# Altium project RK_NVR_DEMO1_RK3588_LP4XD200P232SD8_V21_20211228.PrjPcb (part 9 of 19)
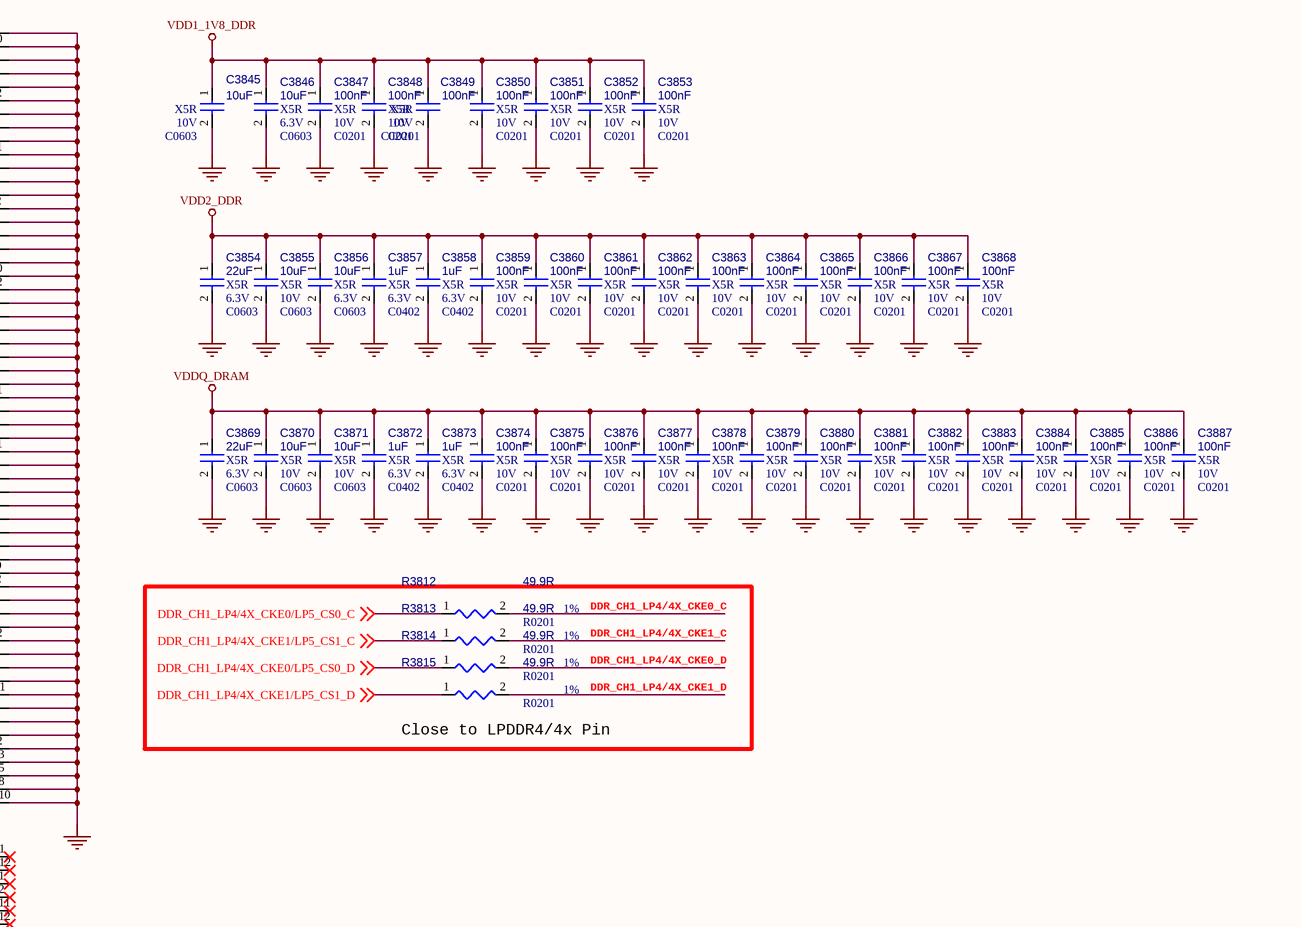
[diagram p80: 38.DRAM-LPDDR4X_200P_1X32bit.SchDoc, bottom right]

## Sheet 38.DRAM-LPDDR4X_200P_1X32bit.SchDoc (continued)

### Nets
GND: C3800.2 C3801.2 C3802.2 C3803.2 C3804.2 C3805.2 C3806.2 C3807.2 C3808.2 C3809.2 C3810.2 C3811.2 C3812.2 C3813.2 C3814.2 C3815.2 C3816.2 C3817.2 C3818.2 C3819.2 C3820.2 C3821.2 C3822.2 C3823.2 C3824.2 C3825.2 C3826.2 C3827.2 C3828.2 C3829.2 C3830.2 C3831.2 C3832.2 C3833.2 C3834.2 C3835.2 C3836.2 C3837.2 C3838.2 C3839.2 C3840.2 C3841.2 C3842.2 C3843.2 C3844.2 C3845.2 C3846.2 C3847.2 C3848.2 C3849.2 C3850.2 C3851.2 C3852.2 C3853.2 C3854.2 C3855.2 C3856.2 C3857.2 C3858.2 C3859.2 C3860.2 C3861.2 C3862.2 C3863.2 C3864.2 C3865.2 C3866.2 C3867.2 C3868.2 C3869.2 C3870.2 C3871.2 C3872.2 C3873.2 C3874.2 C3875.2 C3876.2 C3877.2 C3878.2 C3879.2 C3880.2 C3881.2 C3882.2 C3883.2 C3884.2 C3885.2 C3886.2 C3887.2 C3888.2 U3800.A3(VSS_1) U3800.A10(VSS_2) U3800.AB3(VSS_55) U3800.AB5(VSS_56) U3800.AB8(VSS_57) U3800.AB10(VSS_58) U3800.C1(VSS_3) U3800.C5(VSS_4) U3800.C8(VSS_5) U3800.C12(VSS_6) U3800.D2(VSS_7) U3800.D4(VSS_8) U3800.D9(VSS_9) U3800.D11(VSS_10) U3800.E1(VSS_11) U3800.E5(VSS_12) U3800.E8(VSS_13) U3800.E12(VSS_14) U3800.G1(VSS_15) U3800.G3(VSS_16) U3800.G5(VSS_17) U3800.G8(VSS_18) U3800.G10(VSS_19) U3800.G12(VSS_20) U3800.J1(VSS_21) U3800.J3(VSS_22) U3800.J10(VSS_23) U3800.J12(VSS_24) U3800.K2(VSS_25) U3800.K4(VSS_26) U3800.K9(VSS_27) U3800.K11(VSS_28) U3800.N2(VSS_29) U3800.N4(VSS_30) U3800.N9(VSS_31) U3800.N11(VSS_32) U3800.P1(VSS_33) U3800.P3(VSS_34) U3800.P10(VSS_35) U3800.P12(VSS_36) U3800.T1(VSS_37) U3800.T3(VSS_38) U3800.T5(VSS_39) U3800.T8(VSS_40) U3800.T10(VSS_41) U3800.T12(VSS_42) U3800.V1(VSS_43) U3800.V5(VSS_44) U3800.V8(VSS_45) U3800.V12(VSS_46) U3800.W2(VSS_47) U3800.W4(VSS_48) U3800.W9(VSS_49) U3800.W11(VSS_50) U3800.Y1(VSS_51) U3800.Y5(VSS_52) U3800.Y8(VSS_53) U3800.Y12(VSS_54) U3801.A3(VSS_1) U3801.A10(VSS_2) U3801.AB3(VSS_55) U3801.AB5(VSS_56) U3801.AB8(VSS_57) U3801.AB10(VSS_58) U3801.C1(VSS_3) U3801.C5(VSS_4) U3801.C8(VSS_5) U3801.C12(VSS_6) U3801.D2(VSS_7) U3801.D4(VSS_8) U3801.D9(VSS_9) U3801.D11(VSS_10) U3801.E1(VSS_11) U3801.E5(VSS_12) U3801.E8(VSS_13) U3801.E12(VSS_14) U3801.G1(VSS_15) U3801.G3(VSS_16) U3801.G5(VSS_17) U3801.G8(VSS_18) U3801.G10(VSS_19) U3801.G12(VSS_20) U3801.J1(VSS_21) U3801.J3(VSS_22) U3801.J10(VSS_23) U3801.J12(VSS_24) U3801.K2(VSS_25) U3801.K4(VSS_26) U3801.K9(VSS_27) U3801.K11(VSS_28) U3801.N2(VSS_29) U3801.N4(VSS_30) U3801.N9(VSS_31) U3801.N11(VSS_32) U3801.P1(VSS_33) U3801.P3(VSS_34) U3801.P10(VSS_35) U3801.P12(VSS_36) U3801.T1(VSS_37) U3801.T3(VSS_38) U3801.T5(VSS_39) U3801.T8(VSS_40) U3801.T10(VSS_41) U3801.T12(VSS_42) U3801.V1(VSS_43) U3801.V5(VSS_44) U3801.V8(VSS_45) U3801.V12(VSS_46) U3801.W2(VSS_47) U3801.W4(VSS_48) U3801.W9(VSS_49) U3801.W11(VSS_50) U3801.Y1(VSS_51) U3801.Y5(VSS_52) U3801.Y8(VSS_53) U3801.Y12(VSS_54)
VCC_1V8: C3843.1 R3803.2
VCCA1V8_PLDO6: R3800.2
VDD1_1V8_DDR: C3800.1 C3801.1 C3802.1 C3803.1 C3804.1 C3805.1 C3806.1 C3807.1 C3808.1 C3845.1 C3846.1 C3847.1 C3848.1 C3849.1 C3850.1 C3851.1 C3852.1 C3853.1 R3800.1 R3803.1 U3800.F1(VDD1_1) U3800.F12(VDD1_2) U3800.G4(VDD1_3) U3800.G9(VDD1_4) U3800.T4(VDD1_5) U3800.T9(VDD1_6) U3800.U1(VDD1_7) U3800.U12(VDD1_8) U3801.F1(VDD1_1) U3801.F12(VDD1_2) U3801.G4(VDD1_3) U3801.G9(VDD1_4) U3801.T4(VDD1_5) U3801.T9(VDD1_6) U3801.U1(VDD1_7) U3801.U12(VDD1_8)
VDD2_DDR: C3809.1 C3810.1 C3811.1 C3812.1 C3813.1 C3814.1 C3815.1 C3816.1 C3817.1 C3818.1 C3819.1 C3820.1 C3821.1 C3822.1 C3823.1 C3854.1 C3855.1 C3856.1 C3857.1 C3858.1 C3859.1 C3860.1 C3861.1 C3862.1 C3863.1 C3864.1 C3865.1 C3866.1 C3867.1 C3868.1 R3806.1 R3807.2 R3811.2 R3816.1 R3817.2 U3800.A4(VDD2_1) U3800.A9(VDD2_2) U3800.AB4(VDD2_23) U3800.AB9(VDD2_24) U3800.F5(VDD2_3) U3800.F8(VDD2_4) U3800.H1(VDD2_5) U3800.H5(VDD2_6) U3800.H8(VDD2_7) U3800.H12(VDD2_8) U3800.K1(VDD2_9) U3800.K3(VDD2_10) U3800.K10(VDD2_11) U3800.K12(VDD2_12) U3800.N1(VDD2_13) U3800.N3(VDD2_14) U3800.N10(VDD2_15) U3800.N12(VDD2_16) U3800.R1(VDD2_17) U3800.R5(VDD2_18) U3800.R8(VDD2_19) U3800.R12(VDD2_20) U3800.U5(VDD2_21) U3800.U8(VDD2_22) U3801.A4(VDD2_1) U3801.A9(VDD2_2) U3801.AB4(VDD2_23) U3801.AB9(VDD2_24) U3801.F5(VDD2_3) U3801.F8(VDD2_4) U3801.H1(VDD2_5) U3801.H5(VDD2_6) U3801.H8(VDD2_7) U3801.H12(VDD2_8) U3801.K1(VDD2_9) U3801.K3(VDD2_10) U3801.K10(VDD2_11) U3801.K12(VDD2_12) U3801.N1(VDD2_13) U3801.N3(VDD2_14) U3801.N10(VDD2_15) U3801.N12(VDD2_16) U3801.R1(VDD2_17) U3801.R5(VDD2_18) U3801.R8(VDD2_19) U3801.R12(VDD2_20) U3801.U5(VDD2_21) U3801.U8(VDD2_22)
VDDQ_DDR: R3808.2
VDDQ_DRAM: C3824.1 C3825.1 C3826.1 C3827.1 C3828.1 C3829.1 C3830.1 C3831.1 C3832.1 C3833.1 C3834.1 C3835.1 C3836.1 C3837.1 C3838.1 C3839.1 C3840.1 C3841.1 C3842.1 C3869.1 C3870.1 C3871.1 C3872.1 C3873.1 C3874.1 C3875.1 C3876.1 C3877.1 C3878.1 C3879.1 C3880.1 C3881.1 C3882.1 C3883.1 C3884.1 C3885.1 C3886.1 C3887.1 R3808.1 R3809.1 R3810.1 R3811.1 R3818.1 R3819.1 U3800.AA3(VDDQ_17) U3800.AA5(VDDQ_18) U3800.AA8(VDDQ_19) U3800.AA10(VDDQ_20) U3800.B3(VDDQ_1) U3800.B5(VDDQ_2) U3800.B8(VDDQ_3) U3800.B10(VDDQ_4) U3800.D1(VDDQ_5) U3800.D5(VDDQ_6) U3800.D8(VDDQ_7) U3800.D12(VDDQ_8) U3800.F3(VDDQ_9) U3800.F10(VDDQ_10) U3800.U3(VDDQ_11) U3800.U10(VDDQ_12) U3800.W1(VDDQ_13) U3800.W5(VDDQ_14) U3800.W8(VDDQ_15) U3800.W12(VDDQ_16) U3801.AA3(VDDQ_17) U3801.AA5(VDDQ_18) U3801.AA8(VDDQ_19) U3801.AA10(VDDQ_20) U3801.B3(VDDQ_1) U3801.B5(VDDQ_2) U3801.B8(VDDQ_3) U3801.B10(VDDQ_4) U3801.D1(VDDQ_5) U3801.D5(VDDQ_6) U3801.D8(VDDQ_7) U3801.D12(VDDQ_8) U3801.F3(VDDQ_9) U3801.F10(VDDQ_10) U3801.U3(VDDQ_11) U3801.U10(VDDQ_12) U3801.W1(VDDQ_13) U3801.W5(VDDQ_14) U3801.W8(VDDQ_15) U3801.W12(VDDQ_16)
DDR_CH0_A0_A: U3800.H2(CA0_a) ; off-sheet DDR_CH0_A0_A
DDR_CH0_A0_B: U3800.R2(CA0_b) ; off-sheet DDR_CH0_A0_B
DDR_CH0_A1_A: U3800.J2(CA1_a) ; off-sheet DDR_CH0_A1_A
DDR_CH0_A1_B: U3800.P2(CA1_b) ; off-sheet DDR_CH0_A1_B
DDR_CH0_A2_A: U3800.H9(CA2_a) ; off-sheet DDR_CH0_A2_A
DDR_CH0_A2_B: U3800.R9(CA2_b) ; off-sheet DDR_CH0_A2_B
DDR_CH0_A3_A: U3800.H10(CA3_a) ; off-sheet DDR_CH0_A3_A
DDR_CH0_A3_B: U3800.R10(CA3_b) ; off-sheet DDR_CH0_A3_B
DDR_CH0_A4_A: U3800.H11(CA4_a) ; off-sheet DDR_CH0_A4_A
DDR_CH0_A4_B: U3800.R11(CA4_b) ; off-sheet DDR_CH0_A4_B
DDR_CH0_A5_A: U3800.J11(CA5_a) ; off-sheet DDR_CH0_A5_A
DDR_CH0_A5_B: U3800.P11(CA5_B) ; off-sheet DDR_CH0_A5_B
DDR_CH0_CLKN_A: U3800.J9(CK_c_a) ; off-sheet DDR_CH0_CLKN_A
DDR_CH0_CLKN_B: U3800.P9(CK_c_b) ; off-sheet DDR_CH0_CLKN_B
DDR_CH0_CLKP_A: U3800.J8(CK_t_a) ; off-sheet DDR_CH0_CLKP_A
DDR_CH0_CLKP_B: U3800.P8(CK_t_b) ; off-sheet DDR_CH0_CLKP_B
DDR_CH0_DM0_A: U3800.C3(DMI0_a) ; off-sheet DDR_CH0_DM0_A
DDR_CH0_DM0_B: U3800.Y3(DMI0_b) ; off-sheet DDR_CH0_DM0_B
DDR_CH0_DM1_A: U3800.C10(DMI1_a) ; off-sheet DDR_CH0_DM1_A
DDR_CH0_DM1_B: U3800.Y10(DMI1_b) ; off-sheet DDR_CH0_DM1_B
DDR_CH0_DQ0_A: U3800.B2(DQ0_a) ; off-sheet DDR_CH0_DQ0_A
DDR_CH0_DQ0_B: U3800.AA2(DQ0_b) ; off-sheet DDR_CH0_DQ0_B
DDR_CH0_DQ1_A: U3800.C2(DQ1_a) ; off-sheet DDR_CH0_DQ1_A
DDR_CH0_DQ1_B: U3800.Y2(DQ1_b) ; off-sheet DDR_CH0_DQ1_B
DDR_CH0_DQ2_A: U3800.E2(DQ2_a) ; off-sheet DDR_CH0_DQ2_A
DDR_CH0_DQ2_B: U3800.V2(DQ2_b) ; off-sheet DDR_CH0_DQ2_B
DDR_CH0_DQ3_A: U3800.F2(DQ3_a) ; off-sheet DDR_CH0_DQ3_A
DDR_CH0_DQ3_B: U3800.U2(DQ3_b) ; off-sheet DDR_CH0_DQ3_B
DDR_CH0_DQ4_A: U3800.F4(DQ4_a) ; off-sheet DDR_CH0_DQ4_A
DDR_CH0_DQ4_B: U3800.U4(DQ4_b) ; off-sheet DDR_CH0_DQ4_B
DDR_CH0_DQ5_A: U3800.E4(DQ5_a) ; off-sheet DDR_CH0_DQ5_A
DDR_CH0_DQ5_B: U3800.V4(DQ5_b) ; off-sheet DDR_CH0_DQ5_B
DDR_CH0_DQ6_A: U3800.C4(DQ6_a) ; off-sheet DDR_CH0_DQ6_A
DDR_CH0_DQ6_B: U3800.Y4(DQ6_b) ; off-sheet DDR_CH0_DQ6_B
DDR_CH0_DQ7_A: U3800.B4(DQ7_a) ; off-sheet DDR_CH0_DQ7_A
DDR_CH0_DQ7_B: U3800.AA4(DQ7_b) ; off-sheet DDR_CH0_DQ7_B
DDR_CH0_DQ8_A: U3800.B11(DQ8_a) ; off-sheet DDR_CH0_DQ8_A
DDR_CH0_DQ8_B: U3800.AA11(DQ8_b) ; off-sheet DDR_CH0_DQ8_B
DDR_CH0_DQ9_A: U3800.C11(DQ9_a) ; off-sheet DDR_CH0_DQ9_A
DDR_CH0_DQ9_B: U3800.Y11(DQ9_b) ; off-sheet DDR_CH0_DQ9_B
DDR_CH0_DQ10_A: U3800.E11(DQ10_a) ; off-sheet DDR_CH0_DQ10_A
DDR_CH0_DQ10_B: U3800.V11(DQ10_b) ; off-sheet DDR_CH0_DQ10_B
DDR_CH0_DQ11_A: U3800.F11(DQ11_a) ; off-sheet DDR_CH0_DQ11_A
DDR_CH0_DQ11_B: U3800.U11(DQ11_b) ; off-sheet DDR_CH0_DQ11_B
DDR_CH0_DQ12_A: U3800.F9(DQ12_a) ; off-sheet DDR_CH0_DQ12_A
DDR_CH0_DQ12_B: U3800.U9(DQ12_b) ; off-sheet DDR_CH0_DQ12_B
DDR_CH0_DQ13_A: U3800.E9(DQ13_a) ; off-sheet DDR_CH0_DQ13_A
DDR_CH0_DQ13_B: U3800.V9(DQ13_b) ; off-sheet DDR_CH0_DQ13_B
DDR_CH0_DQ14_A: U3800.C9(DQ14_a) ; off-sheet DDR_CH0_DQ14_A
DDR_CH0_DQ14_B: U3800.Y9(DQ14_b) ; off-sheet DDR_CH0_DQ14_B
DDR_CH0_DQ15_A: U3800.B9(DQ15_a) ; off-sheet DDR_CH0_DQ15_A
DDR_CH0_DQ15_B: U3800.AA9(DQ15_b) ; off-sheet DDR_CH0_DQ15_B
DDR_CH0_DQS0N_A: U3800.E3(DQS0_c_a) ; off-sheet DDR_CH0_DQS0N_A
DDR_CH0_DQS0N_B: U3800.V3(DQS0_c_b) ; off-sheet DDR_CH0_DQS0N_B
DDR_CH0_DQS0P_A: U3800.D3(DQS0_t_a) ; off-sheet DDR_CH0_DQS0P_A
DDR_CH0_DQS0P_B: U3800.W3(DQS0_t_b) ; off-sheet DDR_CH0_DQS0P_B
DDR_CH0_DQS1N_A: U3800.E10(DQS1_c_a) ; off-sheet DDR_CH0_DQS1N_A
DDR_CH0_DQS1N_B: U3800.V10(DQS1_c_b) ; off-sheet DDR_CH0_DQS1N_B
DDR_CH0_DQS1P_A: U3800.D10(DQS1_t_a) ; off-sheet DDR_CH0_DQS1P_A
DDR_CH0_DQS1P_B: U3800.W10(DQS1_t_b) ; off-sheet DDR_CH0_DQS1P_B
DDR_CH0_LP4/4X_CKE0/LP5_CS0_A: R3801.1 ; off-sheet DDR_CH0_LP4/4X_CKE0/LP5_CS0_A
DDR_CH0_LP4/4X_CKE0/LP5_CS0_B: R3804.1 ; off-sheet DDR_CH0_LP4/4X_CKE0/LP5_CS0_B
DDR_CH0_LP4/4X_CKE0_A: R3801.2 U3800.J4(CKE0_a)
DDR_CH0_LP4/4X_CKE0_B: R3804.2 U3800.P4(CKE0_b)
DDR_CH0_LP4/4X_CKE1/LP5_CS1_A: R3802.1 ; off-sheet DDR_CH0_LP4/4X_CKE1/LP5_CS1_A
DDR_CH0_LP4/4X_CKE1/LP5_CS1_B: R3805.1 ; off-sheet DDR_CH0_LP4/4X_CKE1/LP5_CS1_B
DDR_CH0_LP4/4X_CKE1_A: R3802.2 U3800.J5(CKE1_a)
DDR_CH0_LP4/4X_CKE1_B: R3805.2 U3800.P5(CKE1_b)
DDR_CH0_LP4/4X_CS0_A: U3800.H4(CS0_a) ; off-sheet DDR_CH0_LP4/4X_CS0_A
DDR_CH0_LP4/4X_CS0_B: U3800.R4(CS0_b) ; off-sheet DDR_CH0_LP4/4X_CS0_B
DDR_CH0_LP4/4X_CS1_A: U3800.H3(CS1_a) ; off-sheet DDR_CH0_LP4/4X_CS1_A
DDR_CH0_LP4/4X_CS1_B: U3800.R3(CS1_b) ; off-sheet DDR_CH0_LP4/4X_CS1_B
DDR_CH1_A0_C: U3801.H2(CA0_a) ; off-sheet DDR_CH1_A0_C
DDR_CH1_A0_D: U3801.R2(CA0_b) ; off-sheet DDR_CH1_A0_D
DDR_CH1_A1_C: U3801.J2(CA1_a) ; off-sheet DDR_CH1_A1_C
DDR_CH1_A1_D: U3801.P2(CA1_b) ; off-sheet DDR_CH1_A1_D
DDR_CH1_A2_C: U3801.H9(CA2_a) ; off-sheet DDR_CH1_A2_C
DDR_CH1_A2_D: U3801.R9(CA2_b) ; off-sheet DDR_CH1_A2_D
DDR_CH1_A3_C: U3801.H10(CA3_a) ; off-sheet DDR_CH1_A3_C
DDR_CH1_A3_D: U3801.R10(CA3_b) ; off-sheet DDR_CH1_A3_D
DDR_CH1_A4_C: U3801.H11(CA4_a) ; off-sheet DDR_CH1_A4_C
DDR_CH1_A4_D: U3801.R11(CA4_b) ; off-sheet DDR_CH1_A4_D
DDR_CH1_A5_C: U3801.J11(CA5_a) ; off-sheet DDR_CH1_A5_C
DDR_CH1_A5_D: U3801.P11(CA5_B) ; off-sheet DDR_CH1_A5_D
DDR_CH1_CLKN_C: U3801.J9(CK_c_a) ; off-sheet DDR_CH1_CLKN_C
DDR_CH1_CLKN_D: U3801.P9(CK_c_b) ; off-sheet DDR_CH1_CLKN_D
DDR_CH1_CLKP_C: U3801.J8(CK_t_a) ; off-sheet DDR_CH1_CLKP_C
DDR_CH1_CLKP_D: U3801.P8(CK_t_b) ; off-sheet DDR_CH1_CLKP_D
DDR_CH1_DM0_C: U3801.C3(DMI0_a) ; off-sheet DDR_CH1_DM0_C
DDR_CH1_DM0_D: U3801.Y3(DMI0_b) ; off-sheet DDR_CH1_DM0_D
DDR_CH1_DM1_C: U3801.C10(DMI1_a) ; off-sheet DDR_CH1_DM1_C
DDR_CH1_DM1_D: U3801.Y10(DMI1_b) ; off-sheet DDR_CH1_DM1_D
DDR_CH1_DQ0_C: U3801.B2(DQ0_a) ; off-sheet DDR_CH1_DQ0_C
DDR_CH1_DQ0_D: U3801.AA2(DQ0_b) ; off-sheet DDR_CH1_DQ0_D
DDR_CH1_DQ1_C: U3801.C2(DQ1_a) ; off-sheet DDR_CH1_DQ1_C
DDR_CH1_DQ1_D: U3801.Y2(DQ1_b) ; off-sheet DDR_CH1_DQ1_D
DDR_CH1_DQ2_C: U3801.E2(DQ2_a) ; off-sheet DDR_CH1_DQ2_C
DDR_CH1_DQ2_D: U3801.V2(DQ2_b) ; off-sheet DDR_CH1_DQ2_D
DDR_CH1_DQ3_C: U3801.F2(DQ3_a) ; off-sheet DDR_CH1_DQ3_C
DDR_CH1_DQ3_D: U3801.U2(DQ3_b) ; off-sheet DDR_CH1_DQ3_D
DDR_CH1_DQ4_C: U3801.F4(DQ4_a) ; off-sheet DDR_CH1_DQ4_C
DDR_CH1_DQ4_D: U3801.U4(DQ4_b) ; off-sheet DDR_CH1_DQ4_D
DDR_CH1_DQ5_C: U3801.E4(DQ5_a) ; off-sheet DDR_CH1_DQ5_C
DDR_CH1_DQ5_D: U3801.V4(DQ5_b) ; off-sheet DDR_CH1_DQ5_D
DDR_CH1_DQ6_C: U3801.C4(DQ6_a) ; off-sheet DDR_CH1_DQ6_C
DDR_CH1_DQ6_D: U3801.Y4(DQ6_b) ; off-sheet DDR_CH1_DQ6_D
DDR_CH1_DQ7_C: U3801.B4(DQ7_a) ; off-sheet DDR_CH1_DQ7_C
DDR_CH1_DQ7_D: U3801.AA4(DQ7_b) ; off-sheet DDR_CH1_DQ7_D
DDR_CH1_DQ8_C: U3801.B11(DQ8_a) ; off-sheet DDR_CH1_DQ8_C
DDR_CH1_DQ8_D: U3801.AA11(DQ8_b) ; off-sheet DDR_CH1_DQ8_D
DDR_CH1_DQ9_C: U3801.C11(DQ9_a) ; off-sheet DDR_CH1_DQ9_C
DDR_CH1_DQ9_D: U3801.Y11(DQ9_b) ; off-sheet DDR_CH1_DQ9_D
DDR_CH1_DQ10_C: U3801.E11(DQ10_a) ; off-sheet DDR_CH1_DQ10_C
DDR_CH1_DQ10_D: U3801.V11(DQ10_b) ; off-sheet DDR_CH1_DQ10_D
DDR_CH1_DQ11_C: U3801.F11(DQ11_a) ; off-sheet DDR_CH1_DQ11_C
DDR_CH1_DQ11_D: U3801.U11(DQ11_b) ; off-sheet DDR_CH1_DQ11_D
DDR_CH1_DQ12_C: U3801.F9(DQ12_a) ; off-sheet DDR_CH1_DQ12_C
DDR_CH1_DQ12_D: U3801.U9(DQ12_b) ; off-sheet DDR_CH1_DQ12_D
DDR_CH1_DQ13_C: U3801.E9(DQ13_a) ; off-sheet DDR_CH1_DQ13_C
DDR_CH1_DQ13_D: U3801.V9(DQ13_b) ; off-sheet DDR_CH1_DQ13_D
DDR_CH1_DQ14_C: U3801.C9(DQ14_a) ; off-sheet DDR_CH1_DQ14_C
DDR_CH1_DQ14_D: U3801.Y9(DQ14_b) ; off-sheet DDR_CH1_DQ14_D
DDR_CH1_DQ15_C: U3801.B9(DQ15_a) ; off-sheet DDR_CH1_DQ15_C
DDR_CH1_DQ15_D: U3801.AA9(DQ15_b) ; off-sheet DDR_CH1_DQ15_D
DDR_CH1_DQS0N_C: U3801.E3(DQS0_c_a) ; off-sheet DDR_CH1_DQS0N_C
DDR_CH1_DQS0N_D: U3801.V3(DQS0_c_b) ; off-sheet DDR_CH1_DQS0N_D
DDR_CH1_DQS0P_C: U3801.D3(DQS0_t_a) ; off-sheet DDR_CH1_DQS0P_C
DDR_CH1_DQS0P_D: U3801.W3(DQS0_t_b) ; off-sheet DDR_CH1_DQS0P_D
DDR_CH1_DQS1N_C: U3801.E10(DQS1_c_a) ; off-sheet DDR_CH1_DQS1N_C
DDR_CH1_DQS1N_D: U3801.V10(DQS1_c_b) ; off-sheet DDR_CH1_DQS1N_D
DDR_CH1_DQS1P_C: U3801.D10(DQS1_t_a) ; off-sheet DDR_CH1_DQS1P_C
DDR_CH1_DQS1P_D: U3801.W10(DQS1_t_b) ; off-sheet DDR_CH1_DQS1P_D
DDR_CH1_LP4/4X_CKE0/LP5_CS0_C: R3812.1 ; off-sheet DDR_CH1_LP4/4X_CKE0/LP5_CS0_C
DDR_CH1_LP4/4X_CKE0/LP5_CS0_D: R3814.1 ; off-sheet DDR_CH1_LP4/4X_CKE0/LP5_CS0_D
DDR_CH1_LP4/4X_CKE0_C: R3812.2 U3801.J4(CKE0_a)
DDR_CH1_LP4/4X_CKE0_D: R3814.2 U3801.P4(CKE0_b)
DDR_CH1_LP4/4X_CKE1/LP5_CS1_C: R3813.1 ; off-sheet DDR_CH1_LP4/4X_CKE1/LP5_CS1_C
DDR_CH1_LP4/4X_CKE1/LP5_CS1_D: R3815.1 ; off-sheet DDR_CH1_LP4/4X_CKE1/LP5_CS1_D
DDR_CH1_LP4/4X_CKE1_C: R3813.2 U3801.J5(CKE1_a)
DDR_CH1_LP4/4X_CKE1_D: R3815.2 U3801.P5(CKE1_b)
DDR_CH1_LP4/4X_CS0_C: U3801.H4(CS0_a) ; off-sheet DDR_CH1_LP4/4X_CS0_C
DDR_CH1_LP4/4X_CS0_D: U3801.R4(CS0_b) ; off-sheet DDR_CH1_LP4/4X_CS0_D
DDR_CH1_LP4/4X_CS1_C: U3801.H3(CS1_a) ; off-sheet DDR_CH1_LP4/4X_CS1_C
DDR_CH1_LP4/4X_CS1_D: U3801.R3(CS1_b) ; off-sheet DDR_CH1_LP4/4X_CS1_D
DDR_RESET: C3844.1 C3888.1 U3800.T11(RESET_n) U3801.T11(RESET_n) ; off-sheet DDR_RESET
NetR3806_2: R3806.2 U3800.G2(ODT_CA_a)
NetR3807_1: R3807.1 U3800.T2(ODT_CA_b)
NetR3809_2: R3809.2 U3800.A5(ZQ0)
NetR3810_2: R3810.2 U3800.A8(ZQ1)
NetR3816_2: R3816.2 U3801.G2(ODT_CA_a)
NetR3817_1: R3817.1 U3801.T2(ODT_CA_b)
NetR3818_2: R3818.2 U3801.A5(ZQ0)
NetR3819_2: R3819.2 U3801.A8(ZQ1)

Not connected (* = marked no-connect by the designer): U3800 A1(DNU_1)* A2(DNU_2)* A11(DNU_3)* A12(DNU_4)* AA1(DNU_7)* AA12(DNU_8)* AB1(DNU_9)* AB2(DNU_10)* AB11(DNU_11)* AB12(DNU_12)* B1(DNU_5)* B12(DNU_6)* G11(ZQ2_NC)* K5(CS2_a_NC)* K8(CKE2_a_NC)* N5(CS2_b_NC)* N8(CKE2_b_NC)*; U3801 A1(DNU_1)* A2(DNU_2)* A11(DNU_3)* A12(DNU_4)* AA1(DNU_7)* AA12(DNU_8)* AB1(DNU_9)* AB2(DNU_10)* AB11(DNU_11)* AB12(DNU_12)* B1(DNU_5)* B12(DNU_6)* G11(ZQ2_NC)* K5(CS2_a_NC)* K8(CKE2_a_NC)* N5(CS2_b_NC)* N8(CKE2_b_NC)*

### Notes on the sheet
- LPDDR4/4X
- 0.6V
- Sequence:VDD1-VDD2-VDDQ
- LPDDR4x
- LPDDR4
- DNP
- 0R
- (near R3811) 0R
- 1.1V
- LPDDR4    LPDDR4X
  VDD1:  1.70-1.95  1.70-1.95
  VDD2:  1.06-1.17  1.06-1.17
  VDDQ:  1.06-1.17  0.57-0.65
- Rockchip Confidential
- (in symbol LPDDR4_200P, part A) CH A; CH B
- (in symbol LPDDR4_200P, part B) VDD1: 1.8V; LPDDR4  LPDDR4X; VDD2: 1.1V    1.1V; VDDQ: 1.1V    0.6V

### Library data of the parts
C3800 = CAP NP: cap,10.00uF,+/-10%,10V,X5R,C0603; Part Reference: C3800; Manufacturer: TDK; Value: 10uF; Number: 37; RK PN: C1608X5R1A106K080AC; Priority: A; Tolerance: 10%; C_Voltage: 6.3V; PCB Footprint: C0603; Part Type: C0603; Manufacturer PN: C1608X5R1A106K080AC; Created by: JJJ
C3801 = CAP NP: cap,10.00uF,+/-10%,6.3V,X5R,C0603; Part Reference: C3801; Manufacturer: TDK; Value: 10uF; RK PN: C1608X5R0J106K080AB; Priority: A; Tolerance: 10%; PCB Footprint: C0603; Part Type: C0603; Manufacturer PN: C1608X5R0J106K080AB; Created by: JJJ
C3802 = CAP NP: cap,100.00nF,+/-10%,10V,X5R,C0201; Part Reference: C3802; Manufacturer PN: C0603X5R1A104K030BC; Manufacturer: TDK; Value: 100nF; Tolerance: 10%; Priority: A; PCB Footprint: C0201; Created by: JJJ; Part Type: C0201; RK PN: C0603X5R1A104K030BC
C3803 = CAP NP: cap,100.00nF,+/-10%,10V,X5R,C0201; Part Reference: C3803; Manufacturer: TDK; Value: 100nF; RK PN: C0603X5R1A104K030BC; Priority: A; Tolerance: 10%; PCB Footprint: C0201; Part Type: C0201; Manufacturer PN: C0603X5R1A104K030BC; Created by: JJJ
C3804 = CAP NP: cap,100.00nF,+/-10%,10V,X5R,C0201; Part Reference: C3804; Manufacturer PN: C0603X5R1A104K030BC; Manufacturer: TDK; Value: 100nF; C_Voltage: 6.3V; Tolerance: 10%; Priority: A; Number: 37; PCB Footprint: C0201; Created by: JJJ; Part Type: C0201; RK PN: C0603X5R1A104K030BC
C3805 = CAP NP: cap,100.00nF,+/-10%,10V,X5R,C0201; Part Reference: C3805; Manufacturer PN: C0603X5R1A104K030BC; Manufacturer: TDK; Value: 100nF; Tolerance: 10%; Priority: A; PCB Footprint: C0201; Created by: JJJ; Part Type: C0201; RK PN: C0603X5R1A104K030BC
C3806 = CAP NP: cap,100.00nF,+/-10%,10V,X5R,C0201; Part Reference: C3806; Manufacturer PN: C0603X5R1A104K030BC; Manufacturer: TDK; Value: 100nF; Tolerance: 10%; Priority: A; PCB Footprint: C0201; Created by: JJJ; Part Type: C0201; RK PN: C0603X5R1A104K030BC
C3807 = CAP NP: cap,100.00nF,+/-10%,10V,X5R,C0201; Part Reference: C3807; Manufacturer: TDK; Value: 100nF; RK PN: C0603X5R1A104K030BC; Priority: A; Tolerance: 10%; PCB Footprint: C0201; Part Type: C0201; Manufacturer PN: C0603X5R1A104K030BC; Created by: JJJ
C3808 = CAP NP: cap,100.00nF,+/-10%,10V,X5R,C0201; Part Reference: C3808; Manufacturer: TDK; Value: 100nF; RK PN: C0603X5R1A104K030BC; Priority: A; Tolerance: 10%; PCB Footprint: C0201; Part Type: C0201; Manufacturer PN: C0603X5R1A104K030BC; Created by: JJJ
C3809 = CAP NP: cap,22.00uF,+/-20%,6.3V,X5R,C0603; Part Reference: C3809; Manufacturer: TDK; Value: 22uF; RK PN: C1608X5R0J226M080AC; Priority: A; Tolerance: 20%; PCB Footprint: C0603; Part Type: C0603; C_Voltage: 6.3V; Manufacturer PN: C1608X5R0J226M080AC; Created by: JJJ
C3810 = CAP NP: cap,10.00uF,+/-10%,10V,X5R,C0603; Part Reference: C3810; Manufacturer: TDK; Value: 10uF; RK PN: C1608X5R1A106K080AC; Priority: A; C_Voltage: 6.3V; Tolerance: 10%; PCB Footprint: C0603; Part Type: C0603; Manufacturer PN: C1608X5R1A106K080AC; Created by: JJJ
C3811 = CAP NP: cap,10.00uF,+/-10%,6.3V,X5R,C0603; Part Reference: C3811; Manufacturer: TDK; Value: 10uF; RK PN: C1608X5R0J106K080AB; Priority: A; Tolerance: 10%; PCB Footprint: C0603; Part Type: C0603; Manufacturer PN: C1608X5R0J106K080AB; Created by: JJJ
C3812 = CAP NP: cap,1.00uF,+/-10%,6.3V,X5R,C0402; Part Reference: C3812; Manufacturer: TDK; Value: 1uF; RK PN: C1005X5R0J105K050BB; Priority: A; Tolerance: 10%; PCB Footprint: C0402; Part Type: C0402; Manufacturer PN: C1005X5R0J105K050BB; Created by: JJJ
C3813 = CAP NP: cap,1.00uF,+/-10%,6.3V,X5R,C0402; Part Reference: C3813; Manufacturer: TDK; Value: 1uF; RK PN: C1005X5R0J105K050BB; Priority: A; Tolerance: 10%; PCB Footprint: C0402; Part Type: C0402; Manufacturer PN: C1005X5R0J105K050BB; Created by: JJJ
C3814 = CAP NP: cap,100.00nF,+/-10%,10V,X5R,C0201; Part Reference: C3814; Manufacturer: TDK; Value: 100nF; RK PN: C0603X5R1A104K030BC; Priority: A; Tolerance: 10%; PCB Footprint: C0201; Part Type: C0201; Manufacturer PN: C0603X5R1A104K030BC; Created by: JJJ
C3815 = CAP NP: cap,100.00nF,+/-10%,10V,X5R,C0201; Part Reference: C3815; Manufacturer: TDK; Value: 100nF; RK PN: C0603X5R1A104K030BC; Priority: A; Tolerance: 10%; PCB Footprint: C0201; Part Type: C0201; Manufacturer PN: C0603X5R1A104K030BC; Created by: JJJ
C3816 = CAP NP: cap,100.00nF,+/-10%,10V,X5R,C0201; Part Reference: C3816; Manufacturer PN: C0603X5R1A104K030BC; Manufacturer: TDK; Value: 100nF; Tolerance: 10%; Priority: A; PCB Footprint: C0201; Created by: JJJ; Part Type: C0201; RK PN: C0603X5R1A104K030BC
C3817 = CAP NP: cap,100.00nF,+/-10%,10V,X5R,C0201; Part Reference: C3817; Manufacturer: TDK; Value: 100nF; RK PN: C0603X5R1A104K030BC; Priority: A; Tolerance: 10%; PCB Footprint: C0201; Part Type: C0201; Manufacturer PN: C0603X5R1A104K030BC; Created by: JJJ
C3818 = CAP NP: cap,100.00nF,+/-10%,10V,X5R,C0201; Part Reference: C3818; Manufacturer: TDK; Value: 100nF; RK PN: C0603X5R1A104K030BC; Priority: A; Tolerance: 10%; PCB Footprint: C0201; Part Type: C0201; Manufacturer PN: C0603X5R1A104K030BC; Created by: JJJ
C3819 = CAP NP: cap,100.00nF,+/-10%,10V,X5R,C0201; Part Reference: C3819; Manufacturer PN: C0603X5R1A104K030BC; Manufacturer: TDK; Value: 100nF; Tolerance: 10%; Priority: A; PCB Footprint: C0201; Created by: JJJ; Part Type: C0201; RK PN: C0603X5R1A104K030BC
C3820 = CAP NP: cap,100.00nF,+/-10%,10V,X5R,C0201; Part Reference: C3820; Manufacturer PN: C0603X5R1A104K030BC; Manufacturer: TDK; Value: 100nF; Tolerance: 10%; Priority: A; PCB Footprint: C0201; Created by: JJJ; Part Type: C0201; RK PN: C0603X5R1A104K030BC
C3821 = CAP NP: cap,100.00nF,+/-10%,10V,X5R,C0201; Part Reference: C3821; Manufacturer: TDK; Value: 100nF; RK PN: C0603X5R1A104K030BC; Priority: A; Tolerance: 10%; PCB Footprint: C0201; Part Type: C0201; Manufacturer PN: C0603X5R1A104K030BC; Created by: JJJ
C3822 = CAP NP: cap,100.00nF,+/-10%,10V,X5R,C0201; Part Reference: C3822; Manufacturer PN: C0603X5R1A104K030BC; Manufacturer: TDK; Value: 100nF; Tolerance: 10%; Priority: A; PCB Footprint: C0201; Created by: JJJ; Part Type: C0201; RK PN: C0603X5R1A104K030BC
C3823 = CAP NP: cap,100.00nF,+/-10%,10V,X5R,C0201; Part Reference: C3823; Manufacturer: TDK; Value: 100nF; RK PN: C0603X5R1A104K030BC; Priority: A; Tolerance: 10%; PCB Footprint: C0201; Part Type: C0201; Manufacturer PN: C0603X5R1A104K030BC; Created by: JJJ
C3824 = CAP NP: cap,22.00uF,+/-20%,6.3V,X5R,C0603; Part Reference: C3824; Manufacturer PN: C1608X5R0J226M080AC; Manufacturer: TDK; Value: 22uF; Tolerance: 20%; Priority: A; PCB Footprint: C0603; Created by: JJJ; C_Voltage: 6.3V; Part Type: C0603; RK PN: C1608X5R0J226M080AC
C3825 = CAP NP: cap,10.00uF,+/-10%,10V,X5R,C0603; Part Reference: C3825; Manufacturer: TDK; Value: 10uF; RK PN: C1608X5R1A106K080AC; Priority: A; C_Voltage: 6.3V; Tolerance: 10%; PCB Footprint: C0603; Part Type: C0603; Manufacturer PN: C1608X5R1A106K080AC; Created by: JJJ
C3826 = CAP NP: cap,10.00uF,+/-10%,10V,X5R,C0603; Part Reference: C3826; Manufacturer PN: C1608X5R1A106K080AC; Manufacturer: TDK; Value: 10uF; Tolerance: 10%; C_Voltage: 6.3V; Priority: A; PCB Footprint: C0603; Created by: JJJ; Part Type: C0603; RK PN: C1608X5R1A106K080AC
C3827 = CAP NP: cap,1.00uF,+/-10%,6.3V,X5R,C0402; Part Reference: C3827; Manufacturer PN: C1005X5R0J105K050BB; Manufacturer: TDK; Value: 1uF; Tolerance: 10%; Priority: A; PCB Footprint: C0402; Created by: JJJ; Part Type: C0402; RK PN: C1005X5R0J105K050BB
C3828 = CAP NP: cap,1.00uF,+/-10%,6.3V,X5R,C0402; Part Reference: C3828; Manufacturer PN: C1005X5R0J105K050BB; Manufacturer: TDK; Value: 1uF; Tolerance: 10%; Priority: A; PCB Footprint: C0402; Created by: JJJ; Part Type: C0402; RK PN: C1005X5R0J105K050BB
C3829 = CAP NP: cap,100.00nF,+/-10%,10V,X5R,C0201; Part Reference: C3829; Manufacturer PN: C0603X5R1A104K030BC; Manufacturer: TDK; Value: 100nF; Tolerance: 10%; Priority: A; PCB Footprint: C0201; Created by: JJJ; Part Type: C0201; RK PN: C0603X5R1A104K030BC
C3830 = CAP NP: cap,100.00nF,+/-10%,10V,X5R,C0201; Part Reference: C3830; Manufacturer PN: C0603X5R1A104K030BC; Manufacturer: TDK; Value: 100nF; Tolerance: 10%; Priority: A; PCB Footprint: C0201; Created by: JJJ; Part Type: C0201; RK PN: C0603X5R1A104K030BC
C3831 = CAP NP: cap,100.00nF,+/-10%,10V,X5R,C0201; Part Reference: C3831; Manufacturer PN: C0603X5R1A104K030BC; Manufacturer: TDK; Value: 100nF; Tolerance: 10%; Priority: A; PCB Footprint: C0201; Created by: JJJ; Part Type: C0201; RK PN: C0603X5R1A104K030BC
C3832 = CAP NP: cap,100.00nF,+/-10%,10V,X5R,C0201; Part Reference: C3832; Manufacturer: TDK; Value: 100nF; RK PN: C0603X5R1A104K030BC; Priority: A; Tolerance: 10%; PCB Footprint: C0201; Part Type: C0201; Manufacturer PN: C0603X5R1A104K030BC; Created by: JJJ
C3833 = CAP NP: cap,100.00nF,+/-10%,10V,X5R,C0201; Part Reference: C3833; Manufacturer: TDK; Value: 100nF; RK PN: C0603X5R1A104K030BC; Priority: A; Tolerance: 10%; PCB Footprint: C0201; Part Type: C0201; Manufacturer PN: C0603X5R1A104K030BC; Created by: JJJ
C3834 = CAP NP: cap,100.00nF,+/-10%,10V,X5R,C0201; Part Reference: C3834; Manufacturer: TDK; Value: 100nF; RK PN: C0603X5R1A104K030BC; Priority: A; Tolerance: 10%; PCB Footprint: C0201; Part Type: C0201; Manufacturer PN: C0603X5R1A104K030BC; Created by: JJJ
C3835 = CAP NP: cap,100.00nF,+/-10%,10V,X5R,C0201; Part Reference: C3835; Manufacturer PN: C0603X5R1A104K030BC; Manufacturer: TDK; Value: 100nF; Tolerance: 10%; Priority: A; PCB Footprint: C0201; Created by: JJJ; Part Type: C0201; RK PN: C0603X5R1A104K030BC
C3836 = CAP NP: cap,100.00nF,+/-10%,10V,X5R,C0201; Part Reference: C3836; Manufacturer: TDK; Value: 100nF; RK PN: C0603X5R1A104K030BC; Priority: A; Tolerance: 10%; PCB Footprint: C0201; Part Type: C0201; Manufacturer PN: C0603X5R1A104K030BC; Created by: JJJ
C3837 = CAP NP: cap,100.00nF,+/-10%,10V,X5R,C0201; Part Reference: C3837; Manufacturer: TDK; Value: 100nF; RK PN: C0603X5R1A104K030BC; Priority: A; Tolerance: 10%; PCB Footprint: C0201; Part Type: C0201; Manufacturer PN: C0603X5R1A104K030BC; Created by: JJJ
C3838 = CAP NP: cap,100.00nF,+/-10%,10V,X5R,C0201; Part Reference: C3838; Manufacturer PN: C0603X5R1A104K030BC; Manufacturer: TDK; Value: 100nF; Tolerance: 10%; Priority: A; PCB Footprint: C0201; Created by: JJJ; Part Type: C0201; RK PN: C0603X5R1A104K030BC
C3839 = CAP NP: cap,100.00nF,+/-10%,10V,X5R,C0201; Part Reference: C3839; Manufacturer: TDK; Value: 100nF; RK PN: C0603X5R1A104K030BC; Priority: A; Tolerance: 10%; PCB Footprint: C0201; Part Type: C0201; Manufacturer PN: C0603X5R1A104K030BC; Created by: JJJ
C3840 = CAP NP: cap,100.00nF,+/-10%,10V,X5R,C0201; Part Reference: C3840; Manufacturer PN: C0603X5R1A104K030BC; Manufacturer: TDK; Value: 100nF; Tolerance: 10%; Priority: A; PCB Footprint: C0201; Created by: JJJ; Part Type: C0201; RK PN: C0603X5R1A104K030BC
C3841 = CAP NP: cap,100.00nF,+/-10%,10V,X5R,C0201; Part Reference: C3841; Manufacturer PN: C0603X5R1A104K030BC; Manufacturer: TDK; Value: 100nF; Tolerance: 10%; Priority: A; PCB Footprint: C0201; Created by: JJJ; Part Type: C0201; RK PN: C0603X5R1A104K030BC
C3842 = CAP NP: cap,100.00nF,+/-10%,10V,X5R,C0201; Part Reference: C3842; Manufacturer PN: C0603X5R1A104K030BC; Manufacturer: TDK; Value: 100nF; Tolerance: 10%; Priority: A; PCB Footprint: C0201; Created by: JJJ; Part Type: C0201; RK PN: C0603X5R1A104K030BC
C3843 = CAP NP: cap,10.00uF,+/-10%,10V,X5R,C0603; Part Reference: C3843; Manufacturer PN: C1608X5R1A106K080AC; Manufacturer: TDK; Value: 10uF; C_Voltage: 6.3V; Tolerance: 10%; Priority: A; Number: 37; PCB Footprint: C0603; Created by: JJJ; Part Type: C0603; RK PN: C1608X5R1A106K080AC
C3844 = CAP NP: cap,1.00nF,+/-10%,25V,X5R,C0201; Part Reference: C3844; Manufacturer PN: C0603X5R1E102K030BA; Manufacturer: TDK; Value: 1nF; Tolerance: 10%; Priority: A; PCB Footprint: C0201; Created by: JJJ; Part Type: C0201; RK PN: C0603X5R1E102K030BA
C3845 = CAP NP: cap,10.00uF,+/-10%,10V,X5R,C0603; Part Reference: C3845; Manufacturer: TDK; Value: 10uF; Number: 37; RK PN: C1608X5R1A106K080AC; Priority: A; Tolerance: 10%; C_Voltage: 6.3V; PCB Footprint: C0603; Part Type: C0603; Manufacturer PN: C1608X5R1A106K080AC; Created by: JJJ
C3846 = CAP NP: cap,10.00uF,+/-10%,6.3V,X5R,C0603; Part Reference: C3846; Manufacturer: TDK; Value: 10uF; RK PN: C1608X5R0J106K080AB; Priority: A; Tolerance: 10%; PCB Footprint: C0603; Part Type: C0603; Manufacturer PN: C1608X5R0J106K080AB; Created by: JJJ
C3847 = CAP NP: cap,100.00nF,+/-10%,10V,X5R,C0201; Part Reference: C3847; Manufacturer PN: C0603X5R1A104K030BC; Manufacturer: TDK; Value: 100nF; Tolerance: 10%; Priority: A; PCB Footprint: C0201; Created by: JJJ; Part Type: C0201; RK PN: C0603X5R1A104K030BC
C3848 = CAP NP: cap,100.00nF,+/-10%,10V,X5R,C0201; Part Reference: C3848; Manufacturer: TDK; Value: 100nF; RK PN: C0603X5R1A104K030BC; Priority: A; Tolerance: 10%; PCB Footprint: C0201; Part Type: C0201; Manufacturer PN: C0603X5R1A104K030BC; Created by: JJJ
C3849 = CAP NP: cap,100.00nF,+/-10%,10V,X5R,C0201; Part Reference: C3849; Manufacturer PN: C0603X5R1A104K030BC; Manufacturer: TDK; Value: 100nF; C_Voltage: 6.3V; Tolerance: 10%; Priority: A; Number: 37; PCB Footprint: C0201; Created by: JJJ; Part Type: C0201; RK PN: C0603X5R1A104K030BC
C3850 = CAP NP: cap,100.00nF,+/-10%,10V,X5R,C0201; Part Reference: C3850; Manufacturer PN: C0603X5R1A104K030BC; Manufacturer: TDK; Value: 100nF; Tolerance: 10%; Priority: A; PCB Footprint: C0201; Created by: JJJ; Part Type: C0201; RK PN: C0603X5R1A104K030BC
C3851 = CAP NP: cap,100.00nF,+/-10%,10V,X5R,C0201; Part Reference: C3851; Manufacturer PN: C0603X5R1A104K030BC; Manufacturer: TDK; Value: 100nF; Tolerance: 10%; Priority: A; PCB Footprint: C0201; Created by: JJJ; Part Type: C0201; RK PN: C0603X5R1A104K030BC
C3852 = CAP NP: cap,100.00nF,+/-10%,10V,X5R,C0201; Part Reference: C3852; Manufacturer: TDK; Value: 100nF; RK PN: C0603X5R1A104K030BC; Priority: A; Tolerance: 10%; PCB Footprint: C0201; Part Type: C0201; Manufacturer PN: C0603X5R1A104K030BC; Created by: JJJ
C3853 = CAP NP: cap,100.00nF,+/-10%,10V,X5R,C0201; Part Reference: C3853; Manufacturer: TDK; Value: 100nF; RK PN: C0603X5R1A104K030BC; Priority: A; Tolerance: 10%; PCB Footprint: C0201; Part Type: C0201; Manufacturer PN: C0603X5R1A104K030BC; Created by: JJJ
C3854 = CAP NP: cap,22.00uF,+/-20%,6.3V,X5R,C0603; Part Reference: C3854; Manufacturer: TDK; Value: 22uF; RK PN: C1608X5R0J226M080AC; Priority: A; Tolerance: 20%; PCB Footprint: C0603; Part Type: C0603; C_Voltage: 6.3V; Manufacturer PN: C1608X5R0J226M080AC; Created by: JJJ
C3855 = CAP NP: cap,10.00uF,+/-10%,10V,X5R,C0603; Part Reference: C3855; Manufacturer: TDK; Value: 10uF; RK PN: C1608X5R1A106K080AC; Priority: A; C_Voltage: 6.3V; Tolerance: 10%; PCB Footprint: C0603; Part Type: C0603; Manufacturer PN: C1608X5R1A106K080AC; Created by: JJJ
C3856 = CAP NP: cap,10.00uF,+/-10%,6.3V,X5R,C0603; Part Reference: C3856; Manufacturer: TDK; Value: 10uF; RK PN: C1608X5R0J106K080AB; Priority: A; Tolerance: 10%; PCB Footprint: C0603; Part Type: C0603; Manufacturer PN: C1608X5R0J106K080AB; Created by: JJJ
C3857 = CAP NP: cap,1.00uF,+/-10%,6.3V,X5R,C0402; Part Reference: C3857; Manufacturer: TDK; Value: 1uF; RK PN: C1005X5R0J105K050BB; Priority: A; Tolerance: 10%; PCB Footprint: C0402; Part Type: C0402; Manufacturer PN: C1005X5R0J105K050BB; Created by: JJJ
C3858 = CAP NP: cap,1.00uF,+/-10%,6.3V,X5R,C0402; Part Reference: C3858; Manufacturer: TDK; Value: 1uF; RK PN: C1005X5R0J105K050BB; Priority: A; Tolerance: 10%; PCB Footprint: C0402; Part Type: C0402; Manufacturer PN: C1005X5R0J105K050BB; Created by: JJJ
C3859 = CAP NP: cap,100.00nF,+/-10%,10V,X5R,C0201; Part Reference: C3859; Manufacturer: TDK; Value: 100nF; RK PN: C0603X5R1A104K030BC; Priority: A; Tolerance: 10%; PCB Footprint: C0201; Part Type: C0201; Manufacturer PN: C0603X5R1A104K030BC; Created by: JJJ
C3860 = CAP NP: cap,100.00nF,+/-10%,10V,X5R,C0201; Part Reference: C3860; Manufacturer: TDK; Value: 100nF; RK PN: C0603X5R1A104K030BC; Priority: A; Tolerance: 10%; PCB Footprint: C0201; Part Type: C0201; Manufacturer PN: C0603X5R1A104K030BC; Created by: JJJ
C3861 = CAP NP: cap,100.00nF,+/-10%,10V,X5R,C0201; Part Reference: C3861; Manufacturer PN: C0603X5R1A104K030BC; Manufacturer: TDK; Value: 100nF; Tolerance: 10%; Priority: A; PCB Footprint: C0201; Created by: JJJ; Part Type: C0201; RK PN: C0603X5R1A104K030BC
C3862 = CAP NP: cap,100.00nF,+/-10%,10V,X5R,C0201; Part Reference: C3862; Manufacturer: TDK; Value: 100nF; RK PN: C0603X5R1A104K030BC; Priority: A; Tolerance: 10%; PCB Footprint: C0201; Part Type: C0201; Manufacturer PN: C0603X5R1A104K030BC; Created by: JJJ
C3863 = CAP NP: cap,100.00nF,+/-10%,10V,X5R,C0201; Part Reference: C3863; Manufacturer: TDK; Value: 100nF; RK PN: C0603X5R1A104K030BC; Priority: A; Tolerance: 10%; PCB Footprint: C0201; Part Type: C0201; Manufacturer PN: C0603X5R1A104K030BC; Created by: JJJ
C3864 = CAP NP: cap,100.00nF,+/-10%,10V,X5R,C0201; Part Reference: C3864; Manufacturer PN: C0603X5R1A104K030BC; Manufacturer: TDK; Value: 100nF; Tolerance: 10%; Priority: A; PCB Footprint: C0201; Created by: JJJ; Part Type: C0201; RK PN: C0603X5R1A104K030BC
C3865 = CAP NP: cap,100.00nF,+/-10%,10V,X5R,C0201; Part Reference: C3865; Manufacturer PN: C0603X5R1A104K030BC; Manufacturer: TDK; Value: 100nF; Tolerance: 10%; Priority: A; PCB Footprint: C0201; Created by: JJJ; Part Type: C0201; RK PN: C0603X5R1A104K030BC
C3866 = CAP NP: cap,100.00nF,+/-10%,10V,X5R,C0201; Part Reference: C3866; Manufacturer: TDK; Value: 100nF; RK PN: C0603X5R1A104K030BC; Priority: A; Tolerance: 10%; PCB Footprint: C0201; Part Type: C0201; Manufacturer PN: C0603X5R1A104K030BC; Created by: JJJ
C3867 = CAP NP: cap,100.00nF,+/-10%,10V,X5R,C0201; Part Reference: C3867; Manufacturer PN: C0603X5R1A104K030BC; Manufacturer: TDK; Value: 100nF; Tolerance: 10%; Priority: A; PCB Footprint: C0201; Created by: JJJ; Part Type: C0201; RK PN: C0603X5R1A104K030BC
C3868 = CAP NP: cap,100.00nF,+/-10%,10V,X5R,C0201; Part Reference: C3868; Manufacturer: TDK; Value: 100nF; RK PN: C0603X5R1A104K030BC; Priority: A; Tolerance: 10%; PCB Footprint: C0201; Part Type: C0201; Manufacturer PN: C0603X5R1A104K030BC; Created by: JJJ
C3869 = CAP NP: cap,22.00uF,+/-20%,6.3V,X5R,C0603; Part Reference: C3869; Manufacturer PN: C1608X5R0J226M080AC; Manufacturer: TDK; Value: 22uF; Tolerance: 20%; Priority: A; PCB Footprint: C0603; Created by: JJJ; C_Voltage: 6.3V; Part Type: C0603; RK PN: C1608X5R0J226M080AC
C3870 = CAP NP: cap,10.00uF,+/-10%,10V,X5R,C0603; Part Reference: C3870; Manufacturer: TDK; Value: 10uF; RK PN: C1608X5R1A106K080AC; Priority: A; C_Voltage: 6.3V; Tolerance: 10%; PCB Footprint: C0603; Part Type: C0603; Manufacturer PN: C1608X5R1A106K080AC; Created by: JJJ
C3871 = CAP NP: cap,10.00uF,+/-10%,10V,X5R,C0603; Part Reference: C3871; Manufacturer PN: C1608X5R1A106K080AC; Manufacturer: TDK; Value: 10uF; Tolerance: 10%; C_Voltage: 6.3V; Priority: A; PCB Footprint: C0603; Created by: JJJ; Part Type: C0603; RK PN: C1608X5R1A106K080AC
C3872 = CAP NP: cap,1.00uF,+/-10%,6.3V,X5R,C0402; Part Reference: C3872; Manufacturer PN: C1005X5R0J105K050BB; Manufacturer: TDK; Value: 1uF; Tolerance: 10%; Priority: A; PCB Footprint: C0402; Created by: JJJ; Part Type: C0402; RK PN: C1005X5R0J105K050BB
C3873 = CAP NP: cap,1.00uF,+/-10%,6.3V,X5R,C0402; Part Reference: C3873; Manufacturer PN: C1005X5R0J105K050BB; Manufacturer: TDK; Value: 1uF; Tolerance: 10%; Priority: A; PCB Footprint: C0402; Created by: JJJ; Part Type: C0402; RK PN: C1005X5R0J105K050BB
C3874 = CAP NP: cap,100.00nF,+/-10%,10V,X5R,C0201; Part Reference: C3874; Manufacturer PN: C0603X5R1A104K030BC; Manufacturer: TDK; Value: 100nF; Tolerance: 10%; Priority: A; PCB Footprint: C0201; Created by: JJJ; Part Type: C0201; RK PN: C0603X5R1A104K030BC
C3875 = CAP NP: cap,100.00nF,+/-10%,10V,X5R,C0201; Part Reference: C3875; Manufacturer PN: C0603X5R1A104K030BC; Manufacturer: TDK; Value: 100nF; Tolerance: 10%; Priority: A; PCB Footprint: C0201; Created by: JJJ; Part Type: C0201; RK PN: C0603X5R1A104K030BC
C3876 = CAP NP: cap,100.00nF,+/-10%,10V,X5R,C0201; Part Reference: C3876; Manufacturer PN: C0603X5R1A104K030BC; Manufacturer: TDK; Value: 100nF; Tolerance: 10%; Priority: A; PCB Footprint: C0201; Created by: JJJ; Part Type: C0201; RK PN: C0603X5R1A104K030BC
C3877 = CAP NP: cap,100.00nF,+/-10%,10V,X5R,C0201; Part Reference: C3877; Manufacturer: TDK; Value: 100nF; RK PN: C0603X5R1A104K030BC; Priority: A; Tolerance: 10%; PCB Footprint: C0201; Part Type: C0201; Manufacturer PN: C0603X5R1A104K030BC; Created by: JJJ
C3878 = CAP NP: cap,100.00nF,+/-10%,10V,X5R,C0201; Part Reference: C3878; Manufacturer: TDK; Value: 100nF; RK PN: C0603X5R1A104K030BC; Priority: A; Tolerance: 10%; PCB Footprint: C0201; Part Type: C0201; Manufacturer PN: C0603X5R1A104K030BC; Created by: JJJ
C3879 = CAP NP: cap,100.00nF,+/-10%,10V,X5R,C0201; Part Reference: C3879; Manufacturer: TDK; Value: 100nF; RK PN: C0603X5R1A104K030BC; Priority: A; Tolerance: 10%; PCB Footprint: C0201; Part Type: C0201; Manufacturer PN: C0603X5R1A104K030BC; Created by: JJJ
C3880 = CAP NP: cap,100.00nF,+/-10%,10V,X5R,C0201; Part Reference: C3880; Manufacturer PN: C0603X5R1A104K030BC; Manufacturer: TDK; Value: 100nF; Tolerance: 10%; Priority: A; PCB Footprint: C0201; Created by: JJJ; Part Type: C0201; RK PN: C0603X5R1A104K030BC
C3881 = CAP NP: cap,100.00nF,+/-10%,10V,X5R,C0201; Part Reference: C3881; Manufacturer: TDK; Value: 100nF; RK PN: C0603X5R1A104K030BC; Priority: A; Tolerance: 10%; PCB Footprint: C0201; Part Type: C0201; Manufacturer PN: C0603X5R1A104K030BC; Created by: JJJ
C3882 = CAP NP: cap,100.00nF,+/-10%,10V,X5R,C0201; Part Reference: C3882; Manufacturer: TDK; Value: 100nF; RK PN: C0603X5R1A104K030BC; Priority: A; Tolerance: 10%; PCB Footprint: C0201; Part Type: C0201; Manufacturer PN: C0603X5R1A104K030BC; Created by: JJJ
C3883 = CAP NP: cap,100.00nF,+/-10%,10V,X5R,C0201; Part Reference: C3883; Manufacturer PN: C0603X5R1A104K030BC; Manufacturer: TDK; Value: 100nF; Tolerance: 10%; Priority: A; PCB Footprint: C0201; Created by: JJJ; Part Type: C0201; RK PN: C0603X5R1A104K030BC
C3884 = CAP NP: cap,100.00nF,+/-10%,10V,X5R,C0201; Part Reference: C3884; Manufacturer: TDK; Value: 100nF; RK PN: C0603X5R1A104K030BC; Priority: A; Tolerance: 10%; PCB Footprint: C0201; Part Type: C0201; Manufacturer PN: C0603X5R1A104K030BC; Created by: JJJ
C3885 = CAP NP: cap,100.00nF,+/-10%,10V,X5R,C0201; Part Reference: C3885; Manufacturer PN: C0603X5R1A104K030BC; Manufacturer: TDK; Value: 100nF; Tolerance: 10%; Priority: A; PCB Footprint: C0201; Created by: JJJ; Part Type: C0201; RK PN: C0603X5R1A104K030BC
C3886 = CAP NP: cap,100.00nF,+/-10%,10V,X5R,C0201; Part Reference: C3886; Manufacturer PN: C0603X5R1A104K030BC; Manufacturer: TDK; Value: 100nF; Tolerance: 10%; Priority: A; PCB Footprint: C0201; Created by: JJJ; Part Type: C0201; RK PN: C0603X5R1A104K030BC
C3887 = CAP NP: cap,100.00nF,+/-10%,10V,X5R,C0201; Part Reference: C3887; Manufacturer PN: C0603X5R1A104K030BC; Manufacturer: TDK; Value: 100nF; Tolerance: 10%; Priority: A; PCB Footprint: C0201; Created by: JJJ; Part Type: C0201; RK PN: C0603X5R1A104K030BC
C3888 = CAP NP: cap,1.00nF,+/-10%,25V,X5R,C0201; Part Reference: C3888; Manufacturer PN: C0603X5R1E102K030BA; Manufacturer: TDK; Value: 1nF; Tolerance: 10%; Priority: A; PCB Footprint: C0201; Created by: JJJ; Part Type: C0201; RK PN: C0603X5R1E102K030BA
R3800 = RESISTOR_Dup1: НЁУГєсД¤µзЧи,0R,+/-5%,R0603,1/10W.; Part Reference: R3800; Manufacturer: YAGEO; RK PN: RC0603JR-070RL; Priority: A; Wattage: 1/10W; Value: 0R; Part Type: НЁУГєсД¤µзЧи; Manufacturer PN: RC0603JR-070RL; Created by: YTL
R3801 = RESISTOR_Dup1: НЁУГєсД¤µзЧи,49R9,+/-1%,R0201,1/20W.; Part Reference: R3801; Manufacturer: YAGEO; Value: 49.9R; RK PN: RC0201FR-0749R9L; Priority: A; Wattage: 1/20W; Part Type: НЁУГєсД¤µзЧи; Manufacturer PN: RC0201FR-0749R9L; Created by: YTL
R3802 = RESISTOR_Dup1: НЁУГєсД¤µзЧи,49R9,+/-1%,R0201,1/20W.; Part Reference: R3802; Manufacturer: YAGEO; Value: 49.9R; Wattage: 1/20W; RK PN: RC0201FR-0749R9L; Priority: A; Part Type: НЁУГєсД¤µзЧи; Manufacturer PN: RC0201FR-0749R9L; Created by: YTL
R3803 = RESISTOR_Dup1: НЁУГєсД¤µзЧи,0R,+/-5%,R0603,1/10W.; Part Reference: R3803; Manufacturer: YAGEO; RK PN: RC0603JR-070RL; Priority: A; Wattage: 1/10W; Value: 0R; Part Type: НЁУГєсД¤µзЧи; Manufacturer PN: RC0603JR-070RL; Created by: YTL
R3804 = RESISTOR_Dup1: НЁУГєсД¤µзЧи,49R9,+/-1%,R0201,1/20W.; Part Reference: R3804; Manufacturer PN: RC0201FR-0749R9L; Manufacturer: YAGEO; Value: 49.9R; Priority: A; Wattage: 1/20W; Created by: YTL; Part Type: НЁУГєсД¤µзЧи; RK PN: RC0201FR-0749R9L
R3805 = RESISTOR_Dup1: НЁУГєсД¤µзЧи,49R9,+/-1%,R0201,1/20W.; Part Reference: R3805; Manufacturer: YAGEO; Manufacturer PN: RC0201FR-0749R9L; Value: 49.9R; Wattage: 1/20W; Priority: A; Created by: YTL; Part Type: НЁУГєсД¤µзЧи; RK PN: RC0201FR-0749R9L
R3806 = RESISTOR_Dup1: НЁУГєсД¤µзЧи,10K,+/-5%,R0201,1/20W.; Part Reference: R3806; Manufacturer: YAGEO; RK PN: RC0201JR-0710KL; Priority: A; Wattage: 1/20W; Value: 10K; Part Type: НЁУГєсД¤µзЧи; Manufacturer PN: RC0201JR-0710KL; Created by: YTL
R3807 = RESISTOR_Dup1: НЁУГєсД¤µзЧи,10K,+/-5%,R0201,1/20W.; Part Reference: R3807; Manufacturer PN: RC0201JR-0710KL; Manufacturer: YAGEO; Wattage: 1/20W; Priority: A; Value: 10K; Created by: YTL; Part Type: НЁУГєсД¤µзЧи; RK PN: RC0201JR-0710KL
R3808 = RESISTOR_Dup1: НЁУГєсД¤µзЧи,0R,+/-5%,R0805,1/8W.; Part Reference: R3808; Manufacturer: YAGEO; RK PN: RC0805JR-070RL; Priority: A; Wattage: 1/8W; Value: 0R; Part Type: НЁУГєсД¤µзЧи; Manufacturer PN: RC0805JR-070RL; Created by: YTL
R3809 = RESISTOR_Dup1: НЁУГєсД¤µзЧи,240R,+/-1%,R0201,1/20W.; Part Reference: R3809; Manufacturer PN: RC0201FR-07240RL; Manufacturer: YAGEO; Wattage: 1/20W; Priority: A; Value: 240R; Created by: YTL; Part Type: НЁУГєсД¤µзЧи; RK PN: RC0201FR-07240RL
R3810 = RESISTOR_Dup1: НЁУГєсД¤µзЧи,240R,+/-1%,R0201,1/20W.; Part Reference: R3810; Manufacturer: YAGEO; RK PN: RC0201FR-07240RL; Priority: A; Wattage: 1/20W; Value: 240R; Part Type: НЁУГєсД¤µзЧи; Manufacturer PN: RC0201FR-07240RL; Created by: YTL
R3811 = RESISTOR_Dup1: НЁУГєсД¤µзЧи,0R,+/-5%,R0805,1/8W.; Part Reference: R3811; Manufacturer PN: RC0805JR-070RL; Manufacturer: YAGEO; Wattage: 1/8W; Priority: A; Value: 0R; Created by: YTL; Part Type: НЁУГєсД¤µзЧи; RK PN: RC0805JR-070RL
R3812 = RESISTOR_Dup1: НЁУГєсД¤µзЧи,49R9,+/-1%,R0201,1/20W.; Part Reference: R3812; Manufacturer: YAGEO; Value: 49.9R; Wattage: 1/20W; RK PN: RC0201FR-0749R9L; Priority: A; Part Type: НЁУГєсД¤µзЧи; Manufacturer PN: RC0201FR-0749R9L; Created by: YTL
R3813 = RESISTOR_Dup1: НЁУГєсД¤µзЧи,49R9,+/-1%,R0201,1/20W.; Part Reference: R3813; Manufacturer: YAGEO; Manufacturer PN: RC0201FR-0749R9L; Value: 49.9R; Wattage: 1/20W; Priority: A; Created by: YTL; Part Type: НЁУГєсД¤µзЧи; RK PN: RC0201FR-0749R9L
R3814 = RESISTOR_Dup1: НЁУГєсД¤µзЧи,49R9,+/-1%,R0201,1/20W.; Part Reference: R3814; Manufacturer: YAGEO; Manufacturer PN: RC0201FR-0749R9L; Value: 49.9R; Wattage: 1/20W; Priority: A; Created by: YTL; Part Type: НЁУГєсД¤µзЧи; RK PN: RC0201FR-0749R9L
R3815 = RESISTOR_Dup1: НЁУГєсД¤µзЧи,49R9,+/-1%,R0201,1/20W.; Part Reference: R3815; Manufacturer: YAGEO; Value: 49.9R; Wattage: 1/20W; RK PN: RC0201FR-0749R9L; Priority: A; Part Type: НЁУГєсД¤µзЧи; Manufacturer PN: RC0201FR-0749R9L; Created by: YTL
R3816 = RESISTOR_Dup1: НЁУГєсД¤µзЧи,10K,+/-5%,R0201,1/20W.; Part Reference: R3816; Manufacturer PN: RC0201JR-0710KL; Manufacturer: YAGEO; Wattage: 1/20W; Priority: A; Value: 10K; Created by: YTL; Part Type: НЁУГєсД¤µзЧи; RK PN: RC0201JR-0710KL
R3817 = RESISTOR_Dup1: НЁУГєсД¤µзЧи,10K,+/-5%,R0201,1/20W.; Part Reference: R3817; Manufacturer: YAGEO; RK PN: RC0201JR-0710KL; Priority: A; Wattage: 1/20W; Value: 10K; Part Type: НЁУГєсД¤µзЧи; Manufacturer PN: RC0201JR-0710KL; Created by: YTL
R3818 = RESISTOR_Dup1: НЁУГєсД¤µзЧи,240R,+/-1%,R0201,1/20W.; Part Reference: R3818; Manufacturer PN: RC0201FR-07240RL; Manufacturer: YAGEO; Wattage: 1/20W; Priority: A; Value: 240R; Created by: YTL; Part Type: НЁУГєсД¤µзЧи; RK PN: RC0201FR-07240RL
R3819 = RESISTOR_Dup1: НЁУГєсД¤µзЧи,240R,+/-1%,R0201,1/20W.; Part Reference: R3819; Manufacturer PN: RC0201FR-07240RL; Manufacturer: YAGEO; Wattage: 1/20W; Priority: A; Value: 240R; Created by: YTL; Part Type: НЁУГєсД¤µзЧи; RK PN: RC0201FR-07240RL
U3800 = LPDDR4_200P: Part Reference: U3800; PCB Footprint: BGA200_15R00X10R00X0R90; Value: LPDDR4_200P
U3801 = LPDDR4_200P: Part Reference: U3801; PCB Footprint: BGA200_15R00X10R00X0R90; Value: LPDDR4_200P